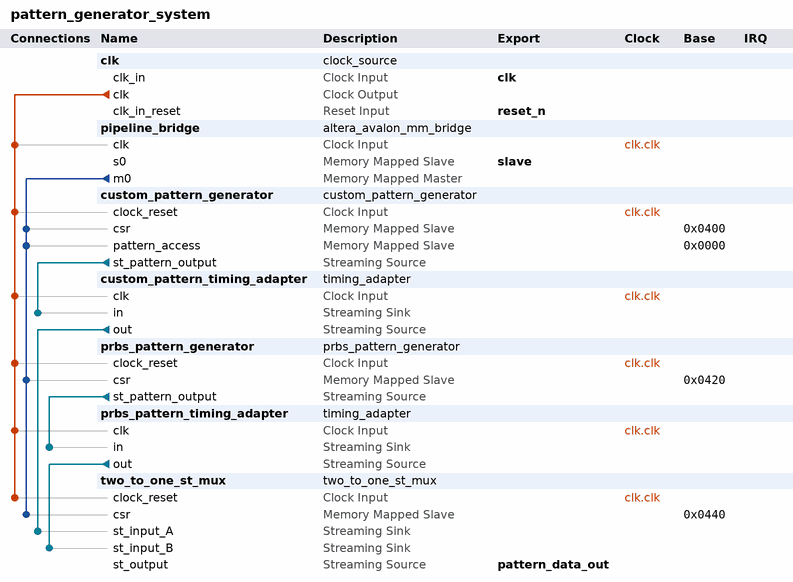
[diagram p0: system contents]
# Platform Designer (Qsys) system pattern_generator_system
# Parameters at their usual value, and those the tool derives, are not listed.
package require -exact qsys 10.1
create_system pattern_generator_system
set_project_property DEVICE_FAMILY CYCLONEIII

add_instance clk clock_source 10.1
set_instance_parameter_value clk clockFrequency 50000000
set_instance_parameter_value clk clockFrequencyKnown false

add_instance pipeline_bridge altera_avalon_mm_bridge 10.1
set_instance_parameter_value pipeline_bridge DATA_WIDTH 32
set_instance_parameter_value pipeline_bridge ADDRESS_WIDTH 11
set_instance_parameter_value pipeline_bridge ADDRESS_UNITS SYMBOLS
set_instance_parameter_value pipeline_bridge BURSTCOUNT_UNITS SYMBOLS
set_instance_parameter_value pipeline_bridge MAX_PENDING_RESPONSES 1

add_instance custom_pattern_generator custom_pattern_generator 1.0
set_instance_parameter_value custom_pattern_generator DATA_WIDTH 32
set_instance_parameter_value custom_pattern_generator MAX_PATTERN_LENGTH 256

add_instance custom_pattern_timing_adapter timing_adapter 10.1
set_instance_parameter_value custom_pattern_timing_adapter inBitsPerSymbol 8
set_instance_parameter_value custom_pattern_timing_adapter inChannelWidth 0
set_instance_parameter_value custom_pattern_timing_adapter inErrorWidth 0
set_instance_parameter_value custom_pattern_timing_adapter inMaxChannel 0
set_instance_parameter_value custom_pattern_timing_adapter inReadyLatency 3
set_instance_parameter_value custom_pattern_timing_adapter inSymbolsPerBeat 4
set_instance_parameter_value custom_pattern_timing_adapter inUseEmptyPort NO
set_instance_parameter_value custom_pattern_timing_adapter inUsePackets false
set_instance_parameter_value custom_pattern_timing_adapter inUseReady true
set_instance_parameter_value custom_pattern_timing_adapter inUseValid true
set_instance_parameter_value custom_pattern_timing_adapter outReadyLatency 0
set_instance_parameter_value custom_pattern_timing_adapter outUseReady true
set_instance_parameter_value custom_pattern_timing_adapter outUseValid true

add_instance prbs_pattern_generator prbs_pattern_generator 1.0
set_instance_parameter_value prbs_pattern_generator DATA_WIDTH 32

add_instance prbs_pattern_timing_adapter timing_adapter 10.1
set_instance_parameter_value prbs_pattern_timing_adapter inBitsPerSymbol 8
set_instance_parameter_value prbs_pattern_timing_adapter inChannelWidth 0
set_instance_parameter_value prbs_pattern_timing_adapter inErrorWidth 0
set_instance_parameter_value prbs_pattern_timing_adapter inMaxChannel 0
set_instance_parameter_value prbs_pattern_timing_adapter inReadyLatency 1
set_instance_parameter_value prbs_pattern_timing_adapter inSymbolsPerBeat 4
set_instance_parameter_value prbs_pattern_timing_adapter inUseEmptyPort NO
set_instance_parameter_value prbs_pattern_timing_adapter inUsePackets false
set_instance_parameter_value prbs_pattern_timing_adapter inUseReady true
set_instance_parameter_value prbs_pattern_timing_adapter inUseValid true
set_instance_parameter_value prbs_pattern_timing_adapter outReadyLatency 0
set_instance_parameter_value prbs_pattern_timing_adapter outUseReady true
set_instance_parameter_value prbs_pattern_timing_adapter outUseValid true

add_instance two_to_one_st_mux two_to_one_st_mux 1.0
set_instance_parameter_value two_to_one_st_mux DATA_WIDTH 32

# connections
add_connection clk.clk custom_pattern_generator.clock_reset clock
add_connection clk.clk custom_pattern_timing_adapter.clk clock
add_connection clk.clk pipeline_bridge.clk clock
add_connection clk.clk prbs_pattern_generator.clock_reset clock
add_connection clk.clk prbs_pattern_timing_adapter.clk clock
add_connection clk.clk two_to_one_st_mux.clock_reset clock
add_connection pipeline_bridge.m0 custom_pattern_generator.csr avalon
set_connection_parameter_value pipeline_bridge.m0/custom_pattern_generator.csr baseAddress 0x0400
add_connection pipeline_bridge.m0 custom_pattern_generator.pattern_access avalon
set_connection_parameter_value pipeline_bridge.m0/custom_pattern_generator.pattern_access baseAddress 0x0000
add_connection pipeline_bridge.m0 prbs_pattern_generator.csr avalon
set_connection_parameter_value pipeline_bridge.m0/prbs_pattern_generator.csr baseAddress 0x0420
add_connection pipeline_bridge.m0 two_to_one_st_mux.csr avalon
set_connection_parameter_value pipeline_bridge.m0/two_to_one_st_mux.csr baseAddress 0x0440
add_connection custom_pattern_generator.st_pattern_output custom_pattern_timing_adapter.in avalon_streaming
add_connection custom_pattern_timing_adapter.out two_to_one_st_mux.st_input_A avalon_streaming
add_connection prbs_pattern_generator.st_pattern_output prbs_pattern_timing_adapter.in avalon_streaming
add_connection prbs_pattern_timing_adapter.out two_to_one_st_mux.st_input_B avalon_streaming

# exported interfaces
add_interface clk clock sink
set_interface_property clk EXPORT_OF clk.clk_in
add_interface reset_n reset sink
set_interface_property reset_n EXPORT_OF clk.clk_in_reset
add_interface slave avalon slave
set_interface_property slave EXPORT_OF pipeline_bridge.s0
add_interface pattern_data_out avalon_streaming source
set_interface_property pattern_data_out EXPORT_OF two_to_one_st_mux.st_output

save_system pattern_generator_system.qsys
